# Altium schematic sheet mbed_programmer_0.SchDoc: mbed_programmer
size 298 x 212 mm; Date: 10.06.2016 15:21:41; SheetNumber: 1
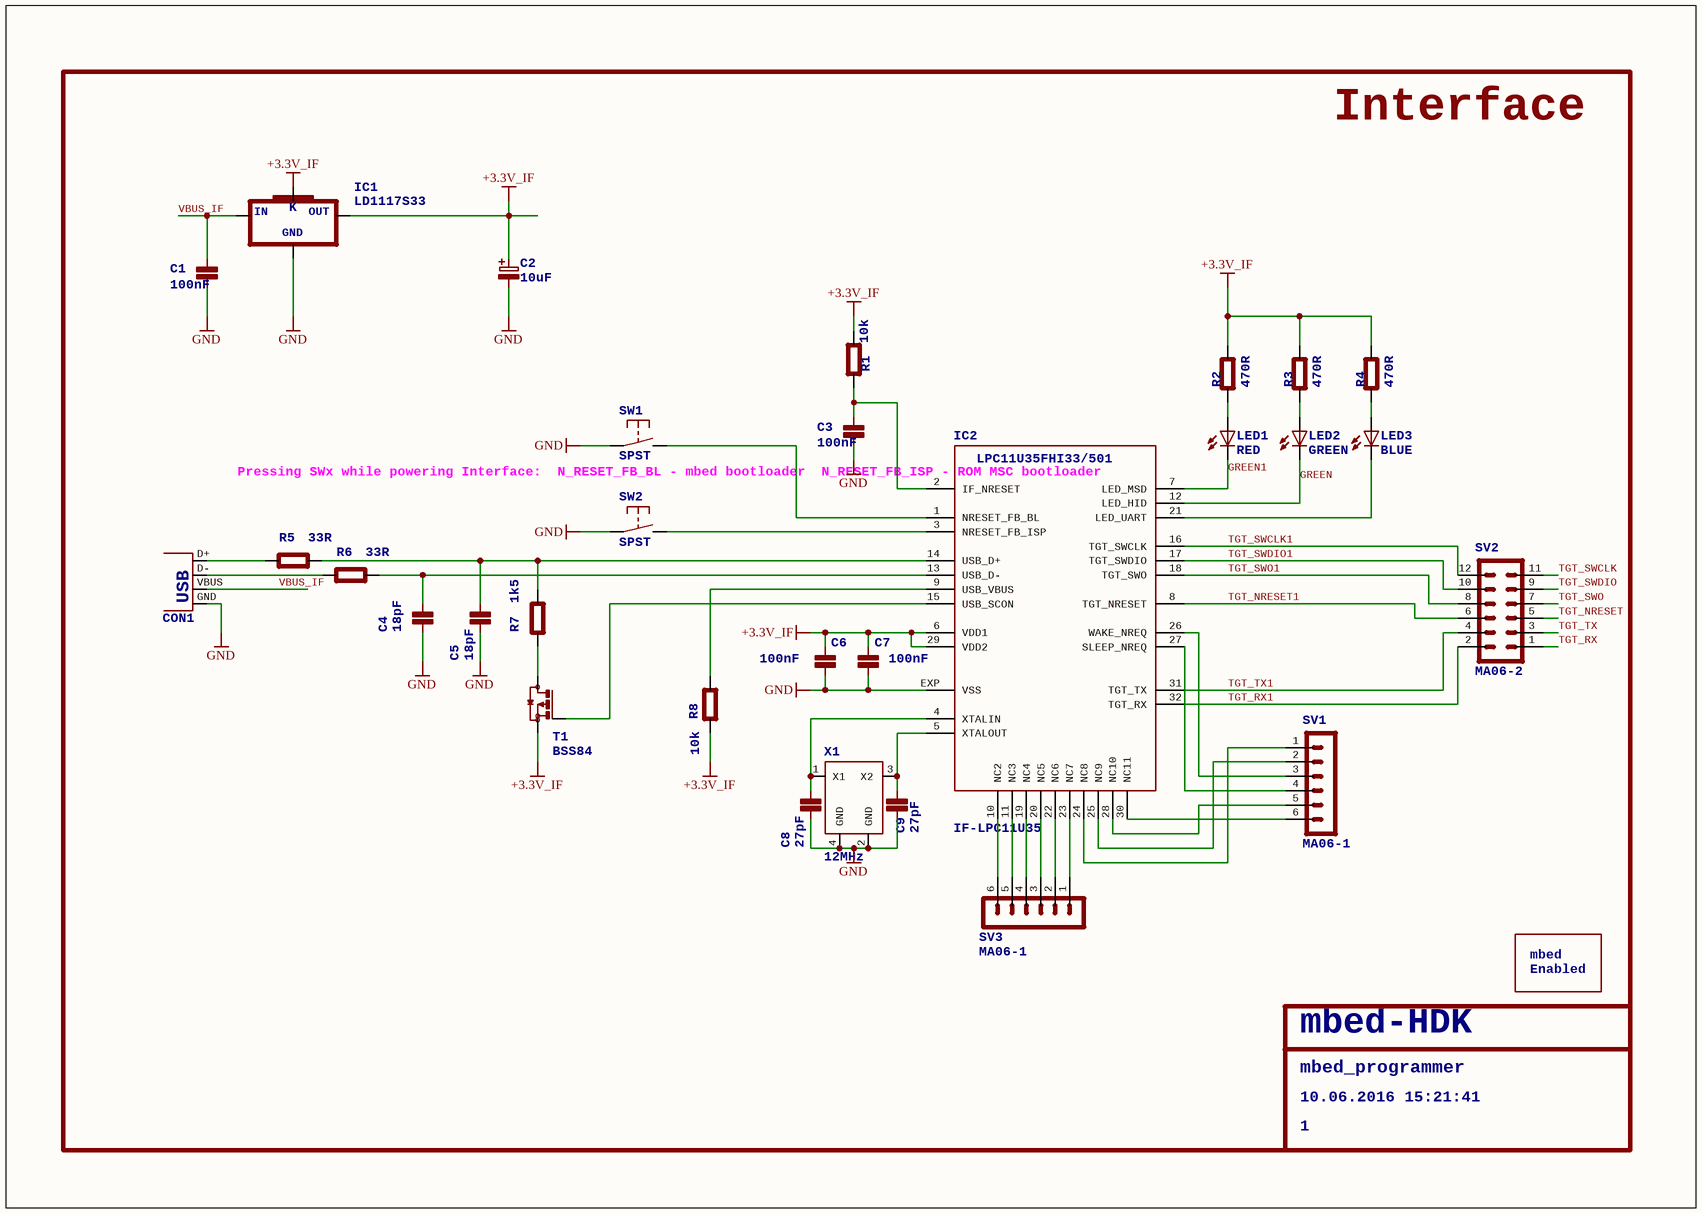
[diagram p0: mbed_programmer_0.SchDoc]

## Parts
C1  100nF  [0603]
C2  10uF  [CASE-B]
C3  100nF  [0603]
C4  18pF  [0603]
C5  18pF  [0603]
C6  100nF  [0603]
C7  100nF  [0603]
C8  27pF  [0603]
C9  27pF  [0603]
CON1  USB-MB-S  [USB-MB-S]  (value not drawn)
IC1  LD1117S33  [SOT223]
IC2  IF-LPC11U35  [HVQFN33]
LED1  RED  [CHIPLED_0603]
LED2  GREEN  [CHIPLED_0603]
LED3  BLUE  [CHIPLED_0603]
R1  10k  [0603]
R2  470R  [0603]
R3  470R  [0603]
R4  470R  [0603]
R5  33R  [0603]
R6  33R  [0603]
R7  1k5  [0603]
R8  10k  [0603]
SS1  MBED-ENABLED-LOGOMEDIUM  [MBED-ENABLED-LOGO-500X500-MIL]  (value not drawn)
SV1  MA06-1  [MA06-1]
SV2  MA06-2  [MA06-2]
SV3  MA06-1  [MA06-1]
SW1  SPST  [DTSM-32S-B]
SW2  SPST  [DTSM-32S-B]
T1  BSS84  [SOT23]
X1  12MHz  [OSC_CMD_32_25]

## Nets
+3.3V_IF: C2.1 C6.1(P$1) C7.1(P$1) IC1.2(OUT) IC1.4(K) IC2.6(VDD1) IC2.29(VDD2) R1.2(P$2) R2.1(P$1) R3.1(P$1) R4.1(P$1) R8.2(P$2) T1.2(S)
GND: C1.2(P$2) C2.2 C3.2(P$2) C4.2(P$2) C5.2(P$2) C6.2(P$2) C7.2(P$2) C8.2(P$2) C9.2(P$2) CON1.GND IC1.1(GND) IC2.EXP(VSS) SW1.P$1(P) SW2.P$1(P) X1.2(GND) X1.4(GND)
GREEN: IC2.12(LED_HID) LED2.C
GREEN1: IC2.7(LED_MSD) LED1.C
TGT_NRESET: SV2.5
TGT_NRESET1: IC2.8(TGT_NRESET) SV2.6
TGT_RX: SV2.1
TGT_RX1: IC2.27(SLEEP_NREQ) IC2.31(TGT_TX) IC2.32(TGT_RX) SV1.4 SV2.2 SV2.4  [also labelled TGT_TX1]
TGT_SWCLK: SV2.11
TGT_SWCLK1: IC2.16(TGT_SWCLK) SV2.12
TGT_SWDIO: SV2.9
TGT_SWDIO1: IC2.17(TGT_SWDIO) SV2.10
TGT_SWO: SV2.7
TGT_SWO1: IC2.18(TGT_SWO) SV2.8
TGT_TX: SV2.3
VBUS_IF: C1.1(P$1) CON1.VBUS IC1.3(IN)
NetC3_1: C3.1(P$1) IC2.2(IF_NRESET) R1.1(P$1)
NetC4_1: C4.1(P$1) IC2.13(USB_D-) R6.2(P$2)
NetC5_1: C5.1(P$1) IC2.14(USB_D+) R5.2(P$2) R7.2(P$2)
NetC8_1: C8.1(P$1) IC2.4(XTALIN) X1.1(X1)
NetC9_1: C9.1(P$1) IC2.5(XTALOUT) X1.3(X2)
NetCON1_D+: CON1.D+ R5.1(P$1)
NetCON1_D-: CON1.D- R6.1(P$1)
NetIC2_1: IC2.1(NRESET_FB_BL) SW1.P$2(S)
NetIC2_3: IC2.3(NRESET_FB_ISP) SW2.P$2(S)
NetIC2_9: IC2.9(USB_VBUS) R8.1(P$1)
NetIC2_10: IC2.10(NC2) SV3.6
NetIC2_11: IC2.11(NC3) SV3.5
NetIC2_15: IC2.15(USB_SCON) T1.1(G)
NetIC2_19: IC2.19(NC4) SV3.4
NetIC2_20: IC2.20(NC5) SV3.3
NetIC2_21: IC2.21(LED_UART) LED3.C
NetIC2_22: IC2.22(NC6) SV3.2
NetIC2_23: IC2.23(NC7) SV3.1
NetIC2_24: IC2.24(NC8) SV1.1
NetIC2_25: IC2.25(NC9) SV1.2
NetIC2_26: IC2.26(WAKE_NREQ) SV1.3
NetIC2_28: IC2.28(NC10) SV1.5
NetIC2_30: IC2.30(NC11) SV1.6
NetLED1_A: LED1.A R2.2(P$2)
NetLED2_A: LED2.A R3.2(P$2)
NetLED3_A: LED3.A R4.2(P$2)
NetR7_1: R7.1(P$1) T1.3(D)

## Notes on the sheet
- Interface
- (near IC2) Pressing SWx while powering Interface:
  N_RESET_FB_BL - mbed bootloader
  N_RESET_FB_ISP - ROM MSC bootloader
- mbed_programmer
- mbed-HDK
- 10.06.2016 15:21:41
- 1

## Library data of the parts
C1 C3-C9 = C0603
C2 = C-POLB
CON1 = USB-MB-S: USB Connectors; USB: USB
IC1 = LD1117S33: VOLTAGE REGULATOR SMD 3,3V; GND: GND; IN: IN; OUT: OUT; K: K
LED1-LED3 = LED0603
R1-R8 = R0603
SV1 SV3 = MA06-1: PIN HEADER; OC_FARNELL: unknown; OC_NEWARK: unknown
SV2 = MA06-2: PIN HEADER; OC_FARNELL: unknown; OC_NEWARK: unknown
T1 = BSS84: P-CHANNEL MOS FET
X1 = ABM8
IC2 = IF-LPC11U35: LPC11U35FHI33/501: LPC11U35FHI33/501
SS1 = MBED-ENABLED-LOGOMEDIUM: mbed: mbed; Enabled: Enabled